# Altium schematic sheet rev02_22.SchDoc
size 282 x 200 mm
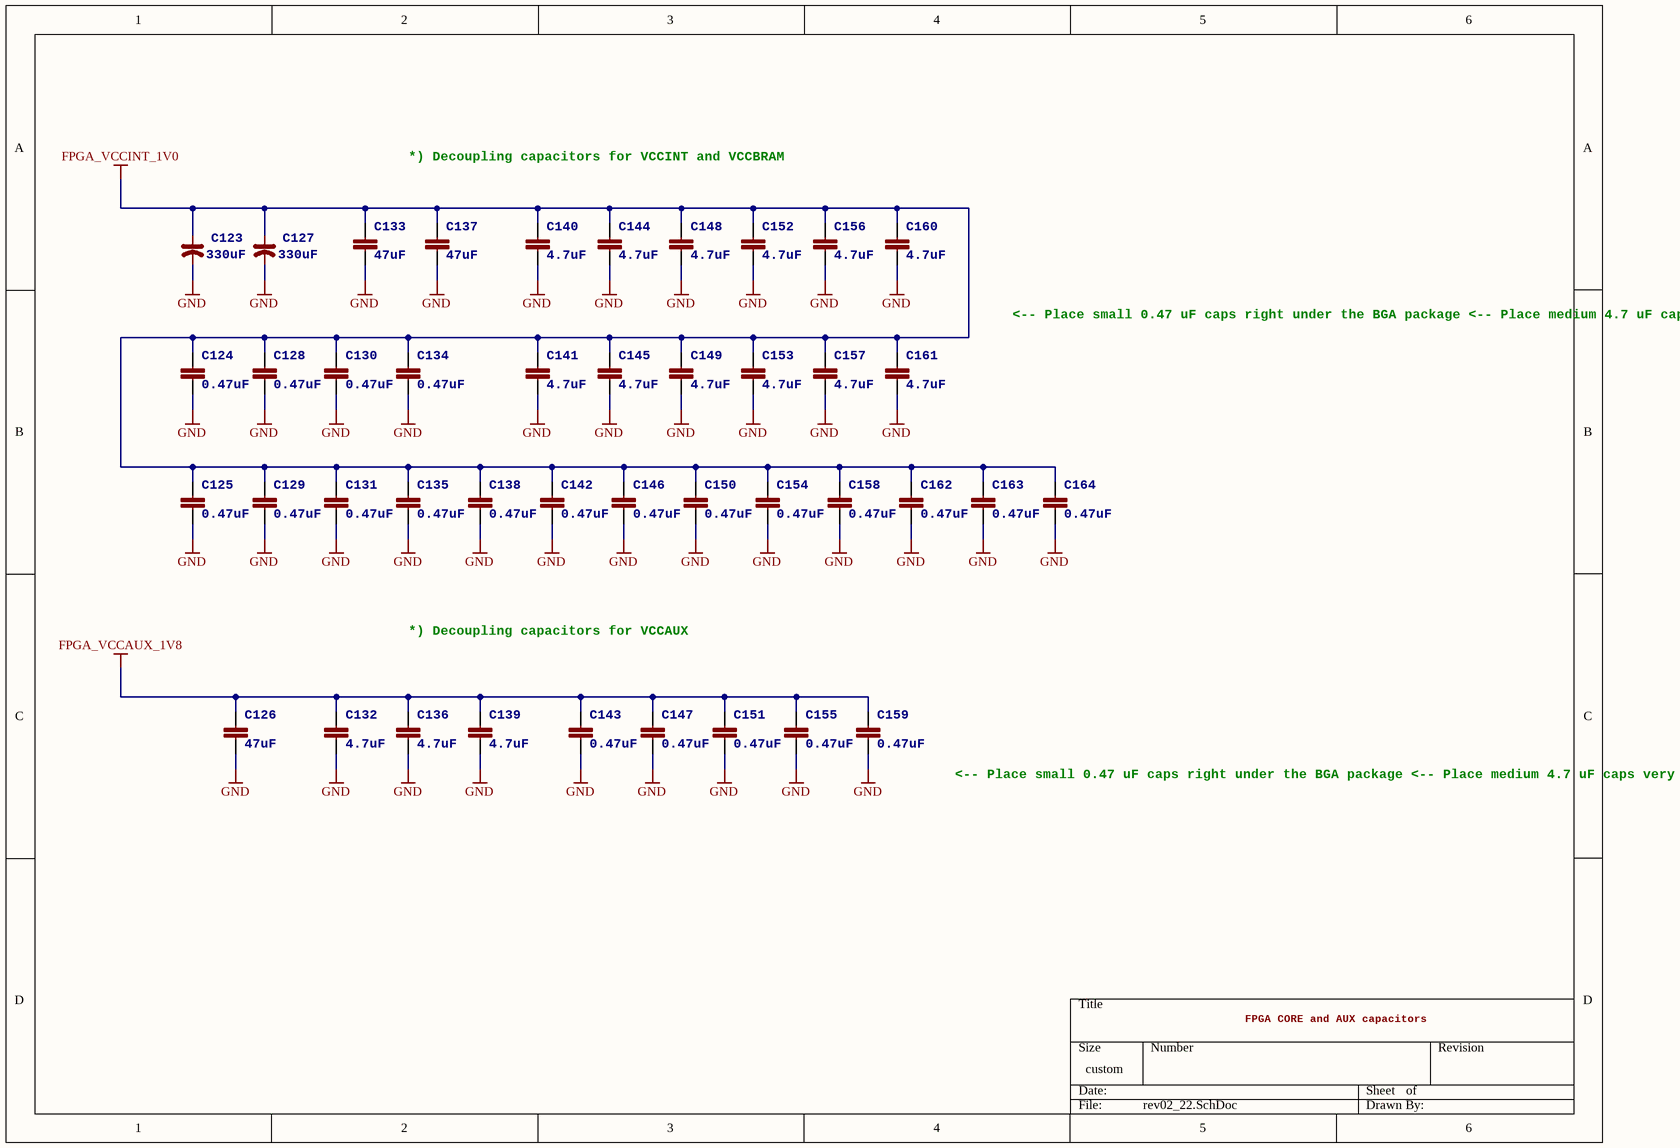
[diagram p0: rev02_22.SchDoc]

## Parts
C123  value 330uF  [C_D]  (hidden comment: T520D337M006ATE015)
C124  value 0.47uF  >NAME: C124  [C_0402]  (hidden comment: GRM155R61A474KE15D)
C125  value 0.47uF  >NAME: C125  [C_0402]  (hidden comment: GRM155R61A474KE15D)
C126  value 47uF  >NAME: C126  [C_1210]  (hidden comment: GRM32ER70J476ME20L)
C127  value 330uF  [C_D]  (hidden comment: T520D337M006ATE015)
C128  value 0.47uF  >NAME: C128  [C_0402]  (hidden comment: GRM155R61A474KE15D)
C129  value 0.47uF  >NAME: C129  [C_0402]  (hidden comment: GRM155R61A474KE15D)
C130  value 0.47uF  >NAME: C130  [C_0402]  (hidden comment: GRM155R61A474KE15D)
C131  value 0.47uF  >NAME: C131  [C_0402]  (hidden comment: GRM155R61A474KE15D)
C132  value 4.7uF  >NAME: C132  [C_0805]  (hidden comment: GRM21BR71A475KA73L)
C133  value 47uF  >NAME: C133  [C_1210]  (hidden comment: GRM32ER70J476ME20L)
C134  value 0.47uF  >NAME: C134  [C_0402]  (hidden comment: GRM155R61A474KE15D)
C135  value 0.47uF  >NAME: C135  [C_0402]  (hidden comment: GRM155R61A474KE15D)
C136  value 4.7uF  >NAME: C136  [C_0805]  (hidden comment: GRM21BR71A475KA73L)
C137  value 47uF  >NAME: C137  [C_1210]  (hidden comment: GRM32ER70J476ME20L)
C138  value 0.47uF  >NAME: C138  [C_0402]  (hidden comment: GRM155R61A474KE15D)
C139  value 4.7uF  >NAME: C139  [C_0805]  (hidden comment: GRM21BR71A475KA73L)
C140  value 4.7uF  >NAME: C140  [C_0805]  (hidden comment: GRM21BR71A475KA73L)
C141  value 4.7uF  >NAME: C141  [C_0805]  (hidden comment: GRM21BR71A475KA73L)
C142  value 0.47uF  >NAME: C142  [C_0402]  (hidden comment: GRM155R61A474KE15D)
C143  value 0.47uF  >NAME: C143  [C_0402]  (hidden comment: GRM155R61A474KE15D)
C144  value 4.7uF  >NAME: C144  [C_0805]  (hidden comment: GRM21BR71A475KA73L)
C145  value 4.7uF  >NAME: C145  [C_0805]  (hidden comment: GRM21BR71A475KA73L)
C146  value 0.47uF  >NAME: C146  [C_0402]  (hidden comment: GRM155R61A474KE15D)
C147  value 0.47uF  >NAME: C147  [C_0402]  (hidden comment: GRM155R61A474KE15D)
C148  value 4.7uF  >NAME: C148  [C_0805]  (hidden comment: GRM21BR71A475KA73L)
C149  value 4.7uF  >NAME: C149  [C_0805]  (hidden comment: GRM21BR71A475KA73L)
C150  value 0.47uF  >NAME: C150  [C_0402]  (hidden comment: GRM155R61A474KE15D)
C151  value 0.47uF  >NAME: C151  [C_0402]  (hidden comment: GRM155R61A474KE15D)
C152  value 4.7uF  >NAME: C152  [C_0805]  (hidden comment: GRM21BR71A475KA73L)
C153  value 4.7uF  >NAME: C153  [C_0805]  (hidden comment: GRM21BR71A475KA73L)
C154  value 0.47uF  >NAME: C154  [C_0402]  (hidden comment: GRM155R61A474KE15D)
C155  value 0.47uF  >NAME: C155  [C_0402]  (hidden comment: GRM155R61A474KE15D)
C156  value 4.7uF  >NAME: C156  [C_0805]  (hidden comment: GRM21BR71A475KA73L)
C157  value 4.7uF  >NAME: C157  [C_0805]  (hidden comment: GRM21BR71A475KA73L)
C158  value 0.47uF  >NAME: C158  [C_0402]  (hidden comment: GRM155R61A474KE15D)
C159  value 0.47uF  >NAME: C159  [C_0402]  (hidden comment: GRM155R61A474KE15D)
C160  value 4.7uF  >NAME: C160  [C_0805]  (hidden comment: GRM21BR71A475KA73L)
C161  value 4.7uF  >NAME: C161  [C_0805]  (hidden comment: GRM21BR71A475KA73L)
C162  value 0.47uF  >NAME: C162  [C_0402]  (hidden comment: GRM155R61A474KE15D)
C163  value 0.47uF  >NAME: C163  [C_0402]  (hidden comment: GRM155R61A474KE15D)
C164  value 0.47uF  >NAME: C164  [C_0402]  (hidden comment: GRM155R61A474KE15D)

## Nets
FPGA_VCCAUX_1V8: C126.1 C132.1 C136.1 C139.1 C143.1 C147.1 C151.1 C155.1 C159.1
FPGA_VCCINT_1V0: C123.1(+) C124.1 C125.1 C127.1(+) C128.1 C129.1 C130.1 C131.1 C133.1 C134.1 C135.1 C137.1 C138.1 C140.1 C141.1 C142.1 C144.1 C145.1 C146.1 C148.1 C149.1 C150.1 C152.1 C153.1 C154.1 C156.1 C157.1 C158.1 C160.1 C161.1 C162.1 C163.1 C164.1
GND: C123.2(-) C124.2 C125.2 C126.2 C127.2(-) C128.2 C129.2 C130.2 C131.2 C132.2 C133.2 C134.2 C135.2 C136.2 C137.2 C138.2 C139.2 C140.2 C141.2 C142.2 C143.2 C144.2 C145.2 C146.2 C147.2 C148.2 C149.2 C150.2 C151.2 C152.2 C153.2 C154.2 C155.2 C156.2 C157.2 C158.2 C159.2 C160.2 C161.2 C162.2 C163.2 C164.2

## Notes on the sheet
- *) Decoupling capacitors for VCCINT and VCCBRAM
- <-- Place small 0.47 uF caps right under the BGA package
  <-- Place medium 4.7 uF caps very close to the BGA
  package
  <-- Place large 47 uF and 330 uF caps not far
  from the BGA package
  <-- Distribute smaller caps evenly under the BGA package
  <-- Distribute larger caps evenly around the BGA package
- *) Decoupling capacitors for VCCAUX
- <-- Place small 0.47 uF caps right under the BGA package
  <-- Place medium 4.7 uF caps very close to the BGA package
  <-- Place large 47 uF caps not far from the BGA package
  <-- Try to place smaller caps next to FPGA balls
- FPGA CORE and AUX capacitors

## Library data of the parts
C123 C127 = CP_E-035X080: Kemet Tantalum Capacitor
C124 C125 C128-C131 C134 C135 C138 C142 C143 C146 C147 C150 C151 C154 C155 C158 C159 C162-C164 = C-EUC0402: 0402 CAPACITOR; DIELECTRIC: X5R; RATED_VOLTAGE: 6.3V; TOLERANCE: 10%
C126 C133 C137 = C-EUC1210: 1210 CAPACITOR X5R 6.3V; RATED_VOLTAGE: 16V; TOLERANCE: 20%; DIELECTRIC: X5R
C132 C136 C139-C141 C144 C145 C148 C149 C152 C153 C156 C157 C160 C161 = C-EUC0603: 0805 CAPACITOR; DIELECTRIC: X5R; RATED_VOLTAGE: 16V; TOLERANCE: 10%